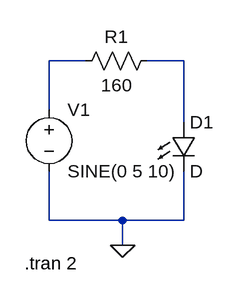
[diagram p0: schematic 1.1.asc]
1.1.asc, the LTspice schematic file:
Version 4
SHEET 1 880 680
WIRE 48 64 0 64
WIRE 176 64 128 64
WIRE 0 128 0 64
WIRE 176 144 176 64
WIRE 0 272 0 208
WIRE 96 272 0 272
WIRE 176 272 176 208
WIRE 176 272 96 272
WIRE 96 304 96 272
FLAG 96 304 0
SYMBOL LED 160 144 R0
SYMATTR InstName D1
SYMBOL voltage 0 112 R0
WINDOW 123 0 0 Left 0
WINDOW 39 0 0 Left 0
SYMATTR InstName V1
SYMATTR Value SINE(0 5 10)
SYMBOL res 144 48 R90
WINDOW 0 0 56 VBottom 2
WINDOW 3 32 56 VTop 2
SYMATTR InstName R1
SYMATTR Value 160
TEXT -32 328 Left 2 !.tran 2

The netlist it stands for:
* 1.1.asc
D1 N002 0 D
V1 N001 0 SINE(0 5 10)
R1 N002 N001 160
.model D D
.lib standard.dio
.tran 2
.backanno
.end